# Altium schematic sheet GSM Stat LED Driver.SchDoc: Modem LED Driver
size 292 x 193 mm; SheetNumber: 10; SheetTotal: 15
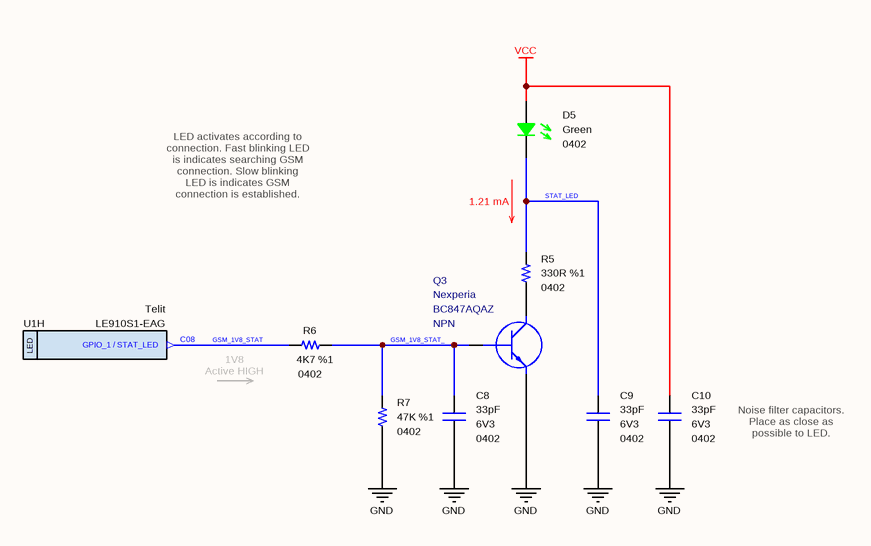
[diagram p0: GSM Stat LED Driver.SchDoc]

## Parts
C8  value 33pF  Case: 0402  Voltage: 6V3  [CAPACITOR_0402]
C9  value 33pF  Case: 0402  Voltage: 6V3  [CAPACITOR_0402]
C10  value 33pF  Case: 0402  Voltage: 6V3  [CAPACITOR_0402]
D5  Case: 0402  Color: Green  [LED_0402]
Q3  Polarity: NPN  Manufacturer Part Number: BC847AQAZ  Manufacturer Name: Nexperia  [SOT1215]
R5  value 330R  Case: 0402  Tolerance: %1  [RESISTOR_0402]
R6  value 4K7  Case: 0402  Tolerance: %1  [RESISTOR_0402]
R7  value 47K  Case: 0402  Tolerance: %1  [RESISTOR_0402]
U1  Manufacturer Part Number: LE910S1-EAG  Manufacturer Name: Telit  [LE910 GSM Modem]  (hidden comment: LE910S1-EAG LTE GSM Module)  (part H of 19)

## Nets
GND: C8.1 C9.1 C10.1 Q3.2(E) R7.1
VCC: C10.2 D5.2
GSM_1V8_STAT: R6.2 U1.C08(GPIO_1_/_STAT_LED)
GSM_1V8_STAT_: C8.2 Q3.1(B) R6.1 R7.2
STAT_LED: C9.2 D5.1 R5.2
NetQ3_3: Q3.3(C) R5.1

## Notes on the sheet
- LED activates according to connection. Fast blinking LED is indicates searching GSM connection. Slow blinking LED is indicates GSM connection is established.
- 1.21 mA
- 1V8
  Active HIGH
- Noise filter capacitors. Place as close as possible to LED.
- © 2021 All rights reserved.
  This document may not, in whole or in part, be copied, photocopied, reproduced, translated or converted to any electronic or machine readable from without prior written permission of Mehmet Günce Akkoyun.
  Engineer contact : akkoyun@me.com
- Property of
- Engineer :
- Date :
- Size :
- A4
- Time :
- Project :
- Page :
- /
- Customer :
- Product ID :
- Module ID :
- Version :
- File :
- Revision :
- (in symbol IC - LE910S1-EAG, part H) LED

## Library data of the parts
C8-C10 = 33pF [0402-6V3]: Capacitor - 33pF [0402] (Ceramic); Manufacturer Part Number: C0402C330J9RACAUTO; Manufacturer Name: Kemet; Dielectric: X7R; Tolerance: 10%; Height: 0.5mm; Maximum Operating Temperature: +125; Minimum Operating Temperature: -55; ROHS: Yes; ComponentLink1Description: DataSheet; ComponentLink1URL: https://api.kemet.com/component-edge/download/datasheet/C0402C330J9RACAUTO.pdf; ComponentLink2Description: Mouser; ComponentLink2URL: https://www.mouser.com/Search/Refine.aspx?Keyword=80-C0402C330J9RAUTO
D5 = LED (0402-Green): Standard LEDs - SMD MINI-MOLD ULTRA COMPACT GREEN; Manufacturer Name: ROHM Semiconductor; Manufacturer Part Number: SML-P12MTT86R; ROHS: Yes; ComponentLink1Description: DataSheet; ComponentLink1URL: https://www.mouser.com.tr/datasheet/2/348/sml-p1-e-1139198.pdf; ComponentLink2Description: Mouser; ComponentLink2URL: https://www.mouser.com.tr/ProductDetail/ROHM-Semiconductor/SML-P12U2TT86R?qs=sGAEpiMZZMseGfSY3csMkRIBDsfU3UCXJTULB5gem9Ta%252Bp%252BvZ709fg%3D%3D
Q3 = BC847: Bipolar NPN Transistors; Case: DFN-1010D-3
R5 = 330R: Thick Film Resistors - SMD 1/16 W 330 Ohm 1%; Manufacturer Name: Vishay; Manufacturer Part Number: CRCW0402330RFKED; Height: 0.4mm; ComponentLink1Description: DataSheet; ComponentLink1URL: https://www.mouser.com.tr/datasheet/2/427/dcrcwe3-1762152.pdf; ComponentLink2Description: Mouser; ComponentLink2URL: https://www.mouser.com.tr/ProductDetail/Vishay-Dale/CRCW0402330RFKED?qs=sGAEpiMZZMu61qfTUdNhG2DpbjADlD3GGS6SwBlLi5Q%3D
R6 = 4K7: Thick Film Resistors - SMD 1/16 W 4.7 Kohms 1%; Manufacturer Name: Vishay; Manufacturer Part Number: CRCW04024K70FKED; Height: 0.4mm; ComponentLink1Description: DataSheet; ComponentLink1URL: https://www.mouser.com.tr/datasheet/2/427/dcrcwe3-1762152.pdf; ComponentLink2Description: Mouser; ComponentLink2URL: https://www.mouser.com.tr/ProductDetail/Vishay-Dale/CRCW04024K70FKED?qs=sGAEpiMZZMu61qfTUdNhG7nHf%2F6MTUn3HadIdDQu24Q%3D
R7 = 47K: Thick Film Resistors - SMD 1/16 W 47 Kohms 1%; Manufacturer Name: Vishay; Manufacturer Part Number: CRCW040247K0FKED; ComponentLink1URL: https://www.mouser.com.tr/datasheet/2/427/dcrcwe3-1762152.pdf; ComponentLink1Description: DataSheet; Height: 0.4mm; ComponentLink2Description: Mouser; ComponentLink2URL: https://www.mouser.com.tr/ProductDetail/Vishay-Dale/CRCW040247K0FKED?qs=sGAEpiMZZMu61qfTUdNhG2DpbjADlD3GL%252B3h1elTxqU%3D
U1 = IC - LE910S1-EAG: Telit LE910S1-EAG GPRS/GNSS Module; Case: BGA